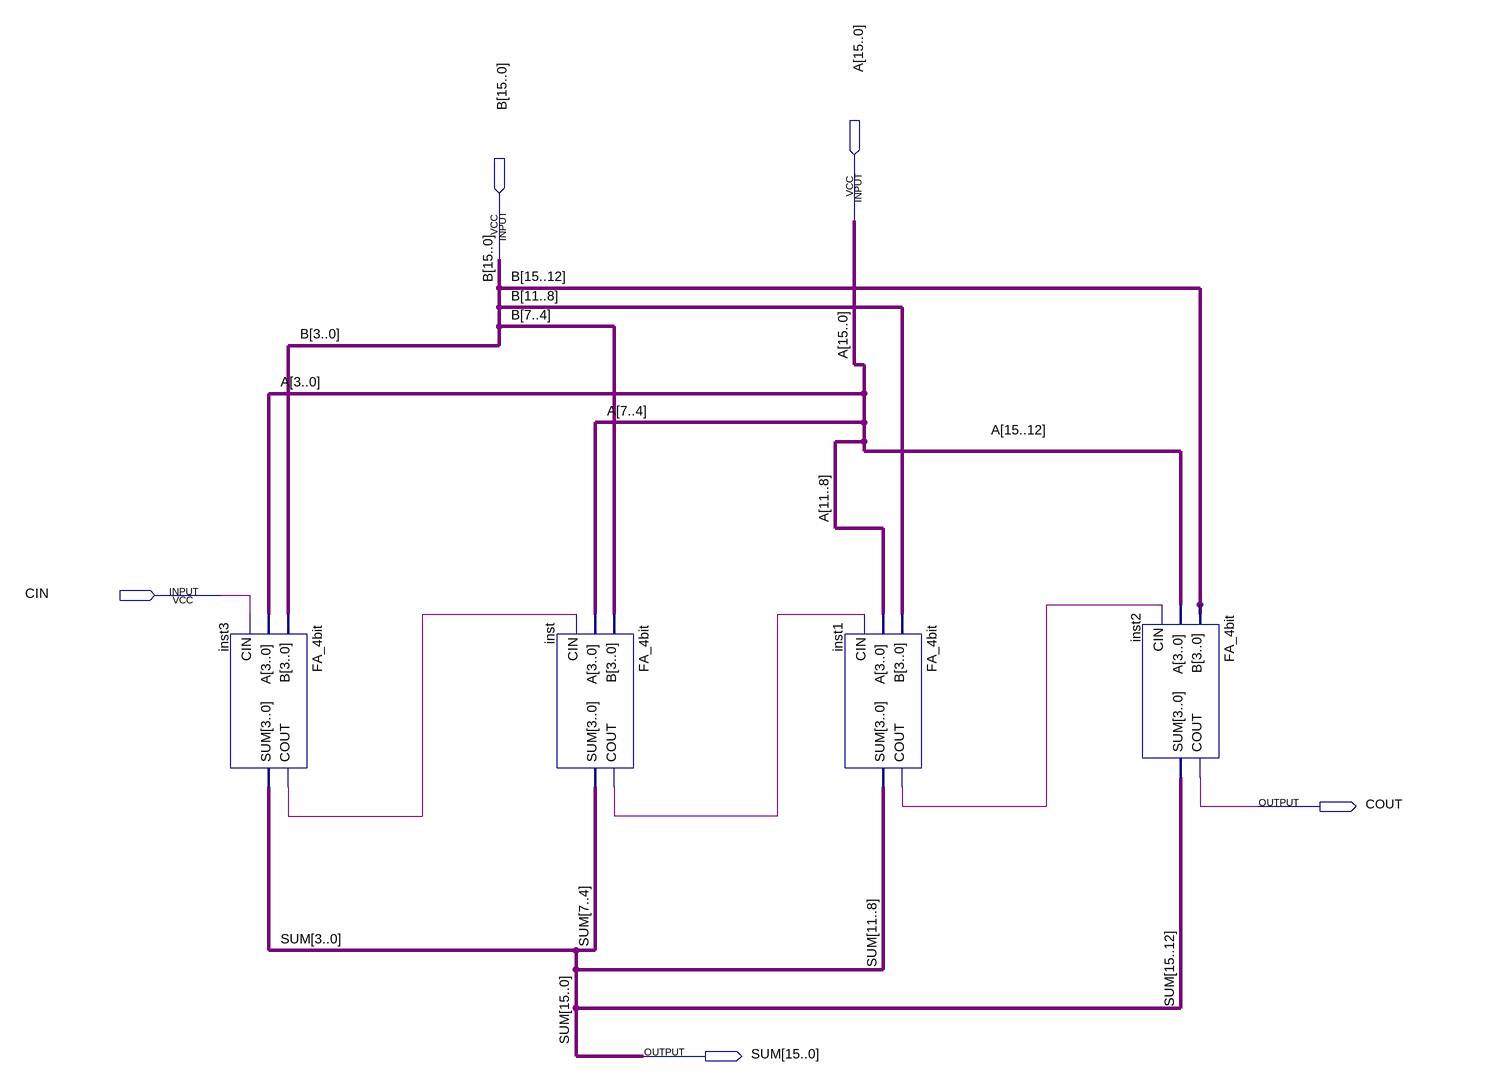
[diagram p0: schematic sheet]
// Quartus schematic FA_16bit.bdf as structural Verilog: 4 symbols, 5 pins
module FA_16bit (
  input  [15:0] A,
  input  [15:0] B,
  input  CIN,
  output COUT,
  output [15:0] SUM
);

  wire inst1_cout, inst3_cout, inst_cout;

  FA_4bit inst3 (.B(B[3:0]), .A(A[3:0]), .CIN(CIN), .COUT(inst3_cout), .SUM(SUM[3:0]));
  FA_4bit inst (.B(B[7:4]), .A(A[7:4]), .CIN(inst3_cout), .COUT(inst_cout), .SUM(SUM[7:4]));
  FA_4bit inst1 (.B(B[11:8]), .A(A[11:8]), .CIN(inst_cout), .COUT(inst1_cout), .SUM(SUM[11:8]));
  FA_4bit inst2 (.B(B[15:12]), .A(A[15:12]), .CIN(inst1_cout), .COUT(COUT), .SUM(SUM[15:12]));
endmodule
